# Altium schematic sheet connectors.SchDoc
size 381 x 241 mm; SheetNumber: 10; SheetTotal: 12
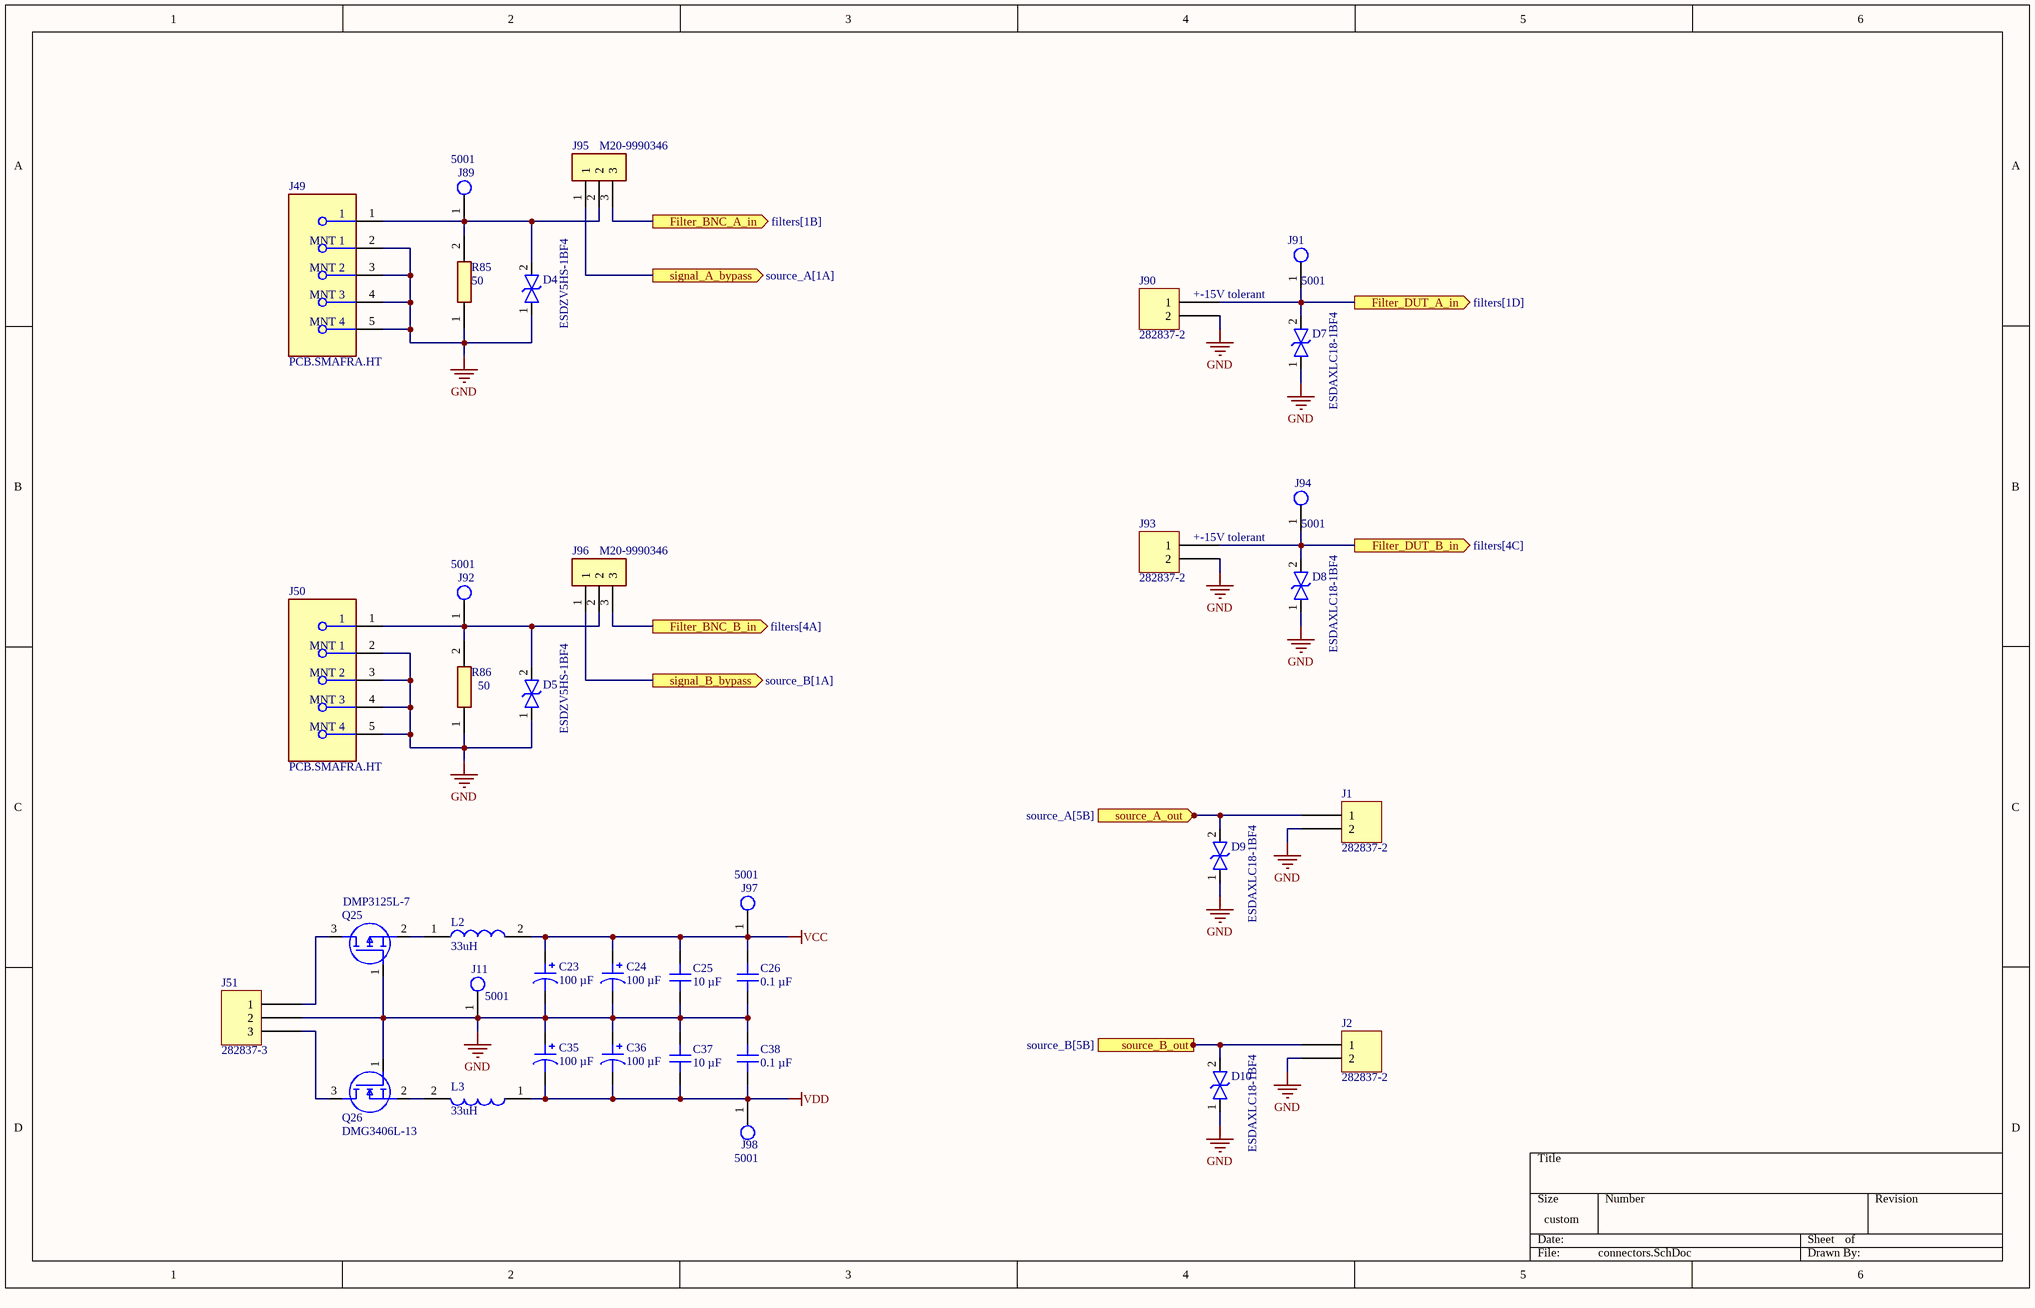
[diagram p0: connectors.SchDoc]

## Parts
C23  100 µF  [CAP ALSMD 8.3MM H10.5MM]
C24  100 µF  [CAP ALSMD 8.3MM H10.5MM]
C25  10 µF  [CAP 1206_3216 - 0.8MM]
C26  0.1 µF  [CAP 1206_3216 - 0.8MM]
C35  100 µF  [CAP ALSMD 8.3MM H10.5MM]
C36  100 µF  [CAP ALSMD 8.3MM H10.5MM]
C37  10 µF  [CAP 1206_3216 - 0.8MM]
C38  0.1 µF  [CAP 1206_3216 - 0.8MM]
D4  ESDZV5HS-1BF4  [ESDZV5HS1BF4]
D5  ESDZV5HS-1BF4  [ESDZV5HS1BF4]
D7  ESDAXLC18-1BF4  [ESDAXLC181BF4]
D8  ESDAXLC18-1BF4  [ESDAXLC181BF4]
D9  ESDAXLC18-1BF4  [ESDAXLC181BF4]
D10  ESDAXLC18-1BF4  [ESDAXLC181BF4]
J1  282837-2  [TE 282837-2]
J2  282837-2  [TE 282837-2]
J11  5001  [FP-5001-MFG]
J49  PCB.SMAFRA.HT  [FP-PCB_SMAFRA_HT-MFG]
J50  PCB.SMAFRA.HT  [FP-PCB_SMAFRA_HT-MFG]
J51  282837-3  [TE 282837-3]
J89  5001  [FP-5001-MFG]
J90  282837-2  [TE 282837-2]
J91  5001  [FP-5001-MFG]
J92  5001  [FP-5001-MFG]
J93  282837-2  [TE 282837-2]
J94  5001  [FP-5001-MFG]
J95  M20-9990346  [HDRV3W64P0X254_1X3_762X254X864P]
J96  M20-9990346  [HDRV3W64P0X254_1X3_762X254X864P]
J97  5001  [FP-5001-MFG]
J98  5001  [FP-5001-MFG]
L2  33uH  [INDPM116102X400N]
L3  33uH  [INDPM116102X400N]
Q25  DMP3125L-7  [SOT96P240X110-3N]
Q26  DMG3406L-13  [SOT96P240X110-3N]
R85  50  [RESC6332X65N]
R86  50  [RESC6332X65N]

## Ports
Filter_BNC_A_in (out, see filters[1B]), Filter_BNC_B_in (out, see filters[4A]), Filter_DUT_A_in (out, see filters[1D]), Filter_DUT_B_in (out, see filters[4C]), signal_A_bypass (out, see source_A[1A]), signal_B_bypass (out, see source_B[1A]), source_A_out (in, see source_A[5B]), source_B_out (in, see source_B[5B])

## Nets
GND: C23.2 C24.2 C25.1 C26.1 C35.1 C36.1 C37.2 C38.2 D4.1 D5.1 D7.1 D8.1 D9.1 D10.1 J1.2 J2.2 J11.1 J49.2(MNT_1) J49.3(MNT_2) J49.4(MNT_3) J49.5(MNT_4) J50.2(MNT_1) J50.3(MNT_2) J50.4(MNT_3) J50.5(MNT_4) J51.2 J90.2 J93.2 Q25.1(G) Q26.1(G) R85.1 R86.1
VCC: C23.1 C24.1 C25.2 C26.2 J97.1 L2.2
VDD: C35.2 C36.2 C37.1 C38.1 J98.1 L3.1
Filter_BNC_A_in: J95.3 ; port Filter_BNC_A_in
Filter_BNC_B_in: J96.3 ; port Filter_BNC_B_in
Filter_DUT_A_in: D7.2 J90.1 J91.1 ; port Filter_DUT_A_in
Filter_DUT_B_in: D8.2 J93.1 J94.1 ; port Filter_DUT_B_in
signal_A_bypass: J95.1 ; port signal_A_bypass
signal_B_bypass: J96.1 ; port signal_B_bypass
source_A_out: D9.2 J1.1 ; port source_A_out
source_B_out: D10.2 J2.1 ; port source_B_out
NetD4_2: D4.2 J49.1 J89.1 J95.2 R85.2
NetD5_2: D5.2 J50.1 J92.1 J96.2 R86.2
NetJ51_1: J51.1 Q25.3(D)
NetJ51_3: J51.3 Q26.3(D)
NetL2_1: L2.1 Q25.2(S)
NetL3_2: L3.2 Q26.2(S)

## Notes on the sheet
- (near J90) +-15V tolerant
- (near J93) +-15V tolerant

## Library data of the parts
C23 C24 C35 C36 = 50TZV100M8X10.5: CAP ALUM 100UF 20% 50V SMD; manufacturer: Rubycon; Impedance: 340 mOhms; Lifetime @ Temp.: 2000 Hrs @ 105°C; Polarization: Polar; Ripple Current @ High Frequency: 350 mA @ 100 kHz; Ripple Current @ Low Frequency: 175 mA @ 120 Hz; Surface Mount Land Size: 0.327" L x 0.327" W (8.30mm x 8.30mm); Part Number: 50TZV100M8X10.5; Applications: Automotive; Capacitance: 100 µF; componentlink1description: Datasheet; componentlink1url: http://www.rubycon.co.jp/en/catalog/e_pdfs/aluminum/e_tzv.pdf; componentlink2description: DigiKey Link; componentlink2url: https://www.digikey.com/en/products/detail/rubycon/50TZV100M8X10-5/3134931; Device Package: Radial, Can - SMD; Height - Seated (Max): 0.413" (10.50mm); lastupdated: 6/3/2024 20:15:48; Lifecycle Status: Active; Minimum Order: 1; Mounting Type: Surface Mount; Operating Temperature: -55°C ~ 105°C; Package / Case: Radial, Can - SMD; packaging: TapeAndReel; partid: 7533; Part Status: Active; price: 0.16; Ratings: AEC-Q200; series: TZV; Size / Dimension: 0.315" Dia (8.00mm); Supplier 1: DigiKey; Supplier Part Number 1: 1189-1651-1-ND; Tolerance: ±20%; value: 100 µF; Voltage - Rated: 50 V
C25 C37 = 885012208069: CAP CER 10UF 25V X7R 1206; manufacturer: Würth Elektronik; Tolerance: ±10%; Part Number: 885012208069; Capacitance: 10 µF; Applications: General Purpose; componentlink1description: Datasheet; componentlink1url: https://katalog.we-online.de/pbs/datasheet/885012208069.pdf; componentlink2description: DigiKey Link; componentlink2url: https://www.digikey.com/en/products/detail/würth-elektronik/885012208069/5453429; Device Package: 1206 (3216 Metric); lastupdated: 6/4/2024 19:10:32; Lifecycle Status: Active; Minimum Order: 1; Mounting Type: Surface Mount, MLCC; Operating Temperature: -55°C ~ 125°C; Package / Case: 1206 (3216 Metric); packaging: TapeAndReel; partid: 43199; Part Status: Active; price: 0.40; series: WCAP-CSGP; Size / Dimension: 0.126" L x 0.063" W (3.20mm x 1.60mm); Supplier 1: DigiKey; Supplier Part Number 1: 732-7574-1-ND; Temperature Coefficient: X7R; Thickness (Max): 0.075" (1.90mm); value: 10 µF; Voltage - Rated: 25V
C26 C38 = 885012208087: CAP CER 0.1UF 50V X7R 1206; manufacturer: Würth Elektronik; Tolerance: ±10%; Part Number: 885012208087; Capacitance: 0.1 µF; Applications: General Purpose; componentlink1description: Datasheet; componentlink1url: https://katalog.we-online.de/pbs/datasheet/885012208087.pdf; componentlink2description: DigiKey Link; componentlink2url: https://www.digikey.com/en/products/detail/würth-elektronik/885012208087/5453982; Device Package: 1206 (3216 Metric); lastupdated: 6/4/2024 19:10:27; Lifecycle Status: Active; Minimum Order: 1; Mounting Type: Surface Mount, MLCC; Operating Temperature: -55°C ~ 125°C; Package / Case: 1206 (3216 Metric); packaging: TapeAndReel; partid: 20879; Part Status: Active; price: 0.06; series: WCAP-CSGP; Size / Dimension: 0.126" L x 0.063" W (3.20mm x 1.60mm); Supplier 1: DigiKey; Supplier Part Number 1: 732-8127-1-ND; Temperature Coefficient: X7R; Thickness (Max): 0.035" (0.90mm); value: 0.1 µF; Voltage - Rated: 50V
D4 D5 = ESDZV5HS-1BF4: TVS Diode (Bi-directional); Manufacturer_Name: STMicroelectronics; Datasheet Link: https://www.st.com/resource/en/datasheet/esdzv5hs-1bf4.pdf; Height: 0.33mm; Manufacturer_Part_Number: ESDZV5HS-1BF4; Mouser Part Number: 511-ESDZV5HS-1BF4; Mouser Price/Stock: https://www.mouser.co.uk/ProductDetail/STMicroelectronics/ESDZV5HS-1BF4?qs=l7cgNqFNU1hPMpLiUWAylw%3D%3D; Arrow Part Number: ESDZV5HS-1BF4; Arrow Price/Stock: https://www.arrow.com/en/products/esdzv5hs-1bf4/stmicroelectronics?region=nac
D7-D10 = ESDAXLC18-1BF4: TVS Diode (Bi-directional); Manufacturer_Name: STMicroelectronics; Datasheet Link: https://www.st.com/resource/en/datasheet/esdaxlc18-1bf4.pdf; Height: 0.32mm; Manufacturer_Part_Number: ESDAXLC18-1BF4; Mouser Part Number: 511-ESDAXLC18-1BF4; Mouser Price/Stock: https://www.mouser.co.uk/ProductDetail/STMicroelectronics/ESDAXLC18-1BF4?qs=Mv7BduZupUgBxpJyOqfYsQ%3D%3D; Arrow Part Number: ESDAXLC18-1BF4; Arrow Price/Stock: https://www.arrow.com/en/products/esdaxlc18-1bf4/stmicroelectronics
J1 J2 J90 J93 = 282837-2: TERM BLK 2P SIDE ENT 5.08MM PCB; Manufacturer: TE Connectivity AMP Connectors; Current: 13.5 A; Mating Orientation: Horizontal with Board; Number of Levels: 1; Pitch: 0.200" (5.08mm); Positions Per Level: 2; Voltage: 300 V; Wire Gauge: 16-28 AWG; Wire Termination: Screw - Rising Cage Clamp; Part Number: 282837-2; Color: Green; ComponentLink1Description: Datasheet; ComponentLink1URL: https://www.te.com/commerce/DocumentDelivery/DDEController?Action=srchrtrv&DocNm=282837&DocType=Customer+Drawing&DocLang=English; ComponentLink2Description: DigiKey Link; ComponentLink2URL: https://www.digikey.com/en/products/detail/te-connectivity-amp-connectors/282837-2/2187973; Features: Interlocking (Side); LastUpdated: 6/21/2022 15:00:23; Lifecycle Status: Active; Minimum Order: 1; Mounting Type: Through Hole; Packaging: Tray; Part Status: Active; Price: 0.31; Series: Buchanan; Supplier 1: DigiKey; Supplier Part Number 1: A113320-ND
J11 J89 J91 J92 J94 J97 J98 = CMP-2000-05181-2: PC TEST POINT MINIATURE BLACK; Body Material: Bronze; Plating: Silver; Inside Diameter: 1.27mm; Hole Diameter: 1.6mm; Number of Ports: 1; Outside Diameter: 2.54mm; Insulation: Insulated; Insulation Material: Nylon; Mount: Through Hole; RoHS Compliant: Yes; Series: THM; Height: 0.3inch; Termination: Through Hole; Material: Nylon; Packaging: Bulk; Contact Material: Bronze; REACH SVHC: No SVHC; Contact Plating: Silver; Orientation: Straight; Lead Free: Lead Free; Package Quantity: 100; Length: 7.62mm; Flammability Rating: UL94 V-0; Number of Contacts: 1; Diameter: 2.54mm; Housing Color: Black; Color: Black
J49 J50 = CMP-111093-000003-1: CONN SMA JACK R/A 50OHM PCB; Dielectric Material: PTFE; Max Frequency: 6GHz; Body Material: Brass; Center Contact Plating: Gold; Voltage Rating: 500V; Operating Frequency: 0 to 6 GHz; Number of Ports: 1; Impedance: 50R; Housing Color: Gold; Mount: Through Hole; Orientation: Right Angle; Termination: Solder; Contact Material: Brass; Series: -; Contact Plating: Gold; Fastening Type: Threaded; Connector Type: SMA; Package Quantity: 500; Case/Package: SMA; Body Plating: Gold; Frequency: 6GHz; Packaging: Tray
J51 = 282837-3: TERM BLK 3P SIDE ENT 5.08MM PCB; Manufacturer: TE Connectivity AMP Connectors; Current: 13.5 A; Mating Orientation: Horizontal with Board; Number of Levels: 1; Pitch: 0.200" (5.08mm); Positions Per Level: 3; Voltage: 300 V; Wire Gauge: 16-28 AWG; Wire Termination: Screw - Rising Cage Clamp; Part Number: 282837-3; Color: Green; ComponentLink1Description: Datasheet; ComponentLink1URL: https://www.te.com/commerce/DocumentDelivery/DDEController?Action=srchrtrv&DocNm=282837&DocType=Customer+Drawing&DocLang=English; ComponentLink2Description: DigiKey Link; ComponentLink2URL: https://www.digikey.com/en/products/detail/te-connectivity-amp-connectors/282837-3/2187974; Features: Interlocking (Side); LastUpdated: 6/21/2022 15:00:39; Lifecycle Status: Active; Minimum Order: 1; Mounting Type: Through Hole; Packaging: Tray; Part Status: Active; Price: 0.47; Series: Buchanan; Supplier 1: DigiKey; Supplier Part Number 1: A113321-ND
J95 J96 = M20-9990346: Connector; Manufacturer_Name: Harwin; Datasheet Link: https://cdn.harwin.com/pdfs/M20-999.pdf; Height: 8.64mm; Manufacturer_Part_Number: M20-9990346; Mouser Part Number: 855-M20-9990346; Mouser Price/Stock: https://www.mouser.co.uk/ProductDetail/Harwin/M20-9990346?qs=ulE8k0yEMYbyhQ3uXpFs8Q%3D%3D
L2 L3 = AMRM00101040330MA1: Inductor; Manufacturer_Name: Pulse Electronics; Datasheet Link: https://productfinder.pulseelectronics.com/api/open/part-attachments/datasheet/amrm00101040330ma1; Height: 4mm; Manufacturer_Part_Number: AMRM00101040330MA1; Mouser Part Number: 673-AMRM101040330MA1; Mouser Price/Stock: https://www.mouser.co.uk/ProductDetail/Pulse-Electronics/AMRM00101040330MA1?qs=HoCaDK9Nz5eI6M5ad0CXDA%3D%3D; Value: 33uH
Q25 = DMP3125L-7: MOSFET (P-Channel); Manufacturer_Name: Diodes Incorporated; Datasheet Link: https://www.diodes.com//assets/Datasheets/DMP3125L.pdf; Height: 1.1mm; Manufacturer_Part_Number: DMP3125L-7; Mouser Part Number: 621-DMP3125L-7; Mouser Price/Stock: https://www.mouser.co.uk/ProductDetail/Diodes-Incorporated/DMP3125L-7?qs=W0yvOO0ixfH8ma8MdHfXQA%3D%3D; Arrow Part Number: DMP3125L-7; Arrow Price/Stock: https://www.arrow.com/en/products/dmp3125l-7/diodes-incorporated?region=nac
Q26 = DMG3406L-13: MOSFET (N-Channel); Manufacturer_Name: Diodes Incorporated; Datasheet Link: https://www.diodes.com//assets/Datasheets/DMG3406L.pdf; Height: 1.1mm; Manufacturer_Part_Number: DMG3406L-13; Mouser Part Number: 621-DMG3406L-13; Mouser Price/Stock: https://www.mouser.co.uk/ProductDetail/Diodes-Incorporated/DMG3406L-13?qs=BvpHGKeVh3r%252BRZTTCOfjpg%3D%3D; Arrow Part Number: DMG3406L-13; Arrow Price/Stock: https://www.arrow.com/en/products/dmg3406l-13/diodes-incorporated?region=nac
R85 R86 = RNCL2512FT50R0: Resistor; Manufacturer_Name: Stackpole Electronics; Datasheet Link: https://www.seielect.com/catalog/sei-rncl.pdf; Height: 0.65mm; Manufacturer_Part_Number: RNCL2512FT50R0; Resistance: 50